# EAGLE design ARM-Cortex_M0 (EAGLE 7.7.0)
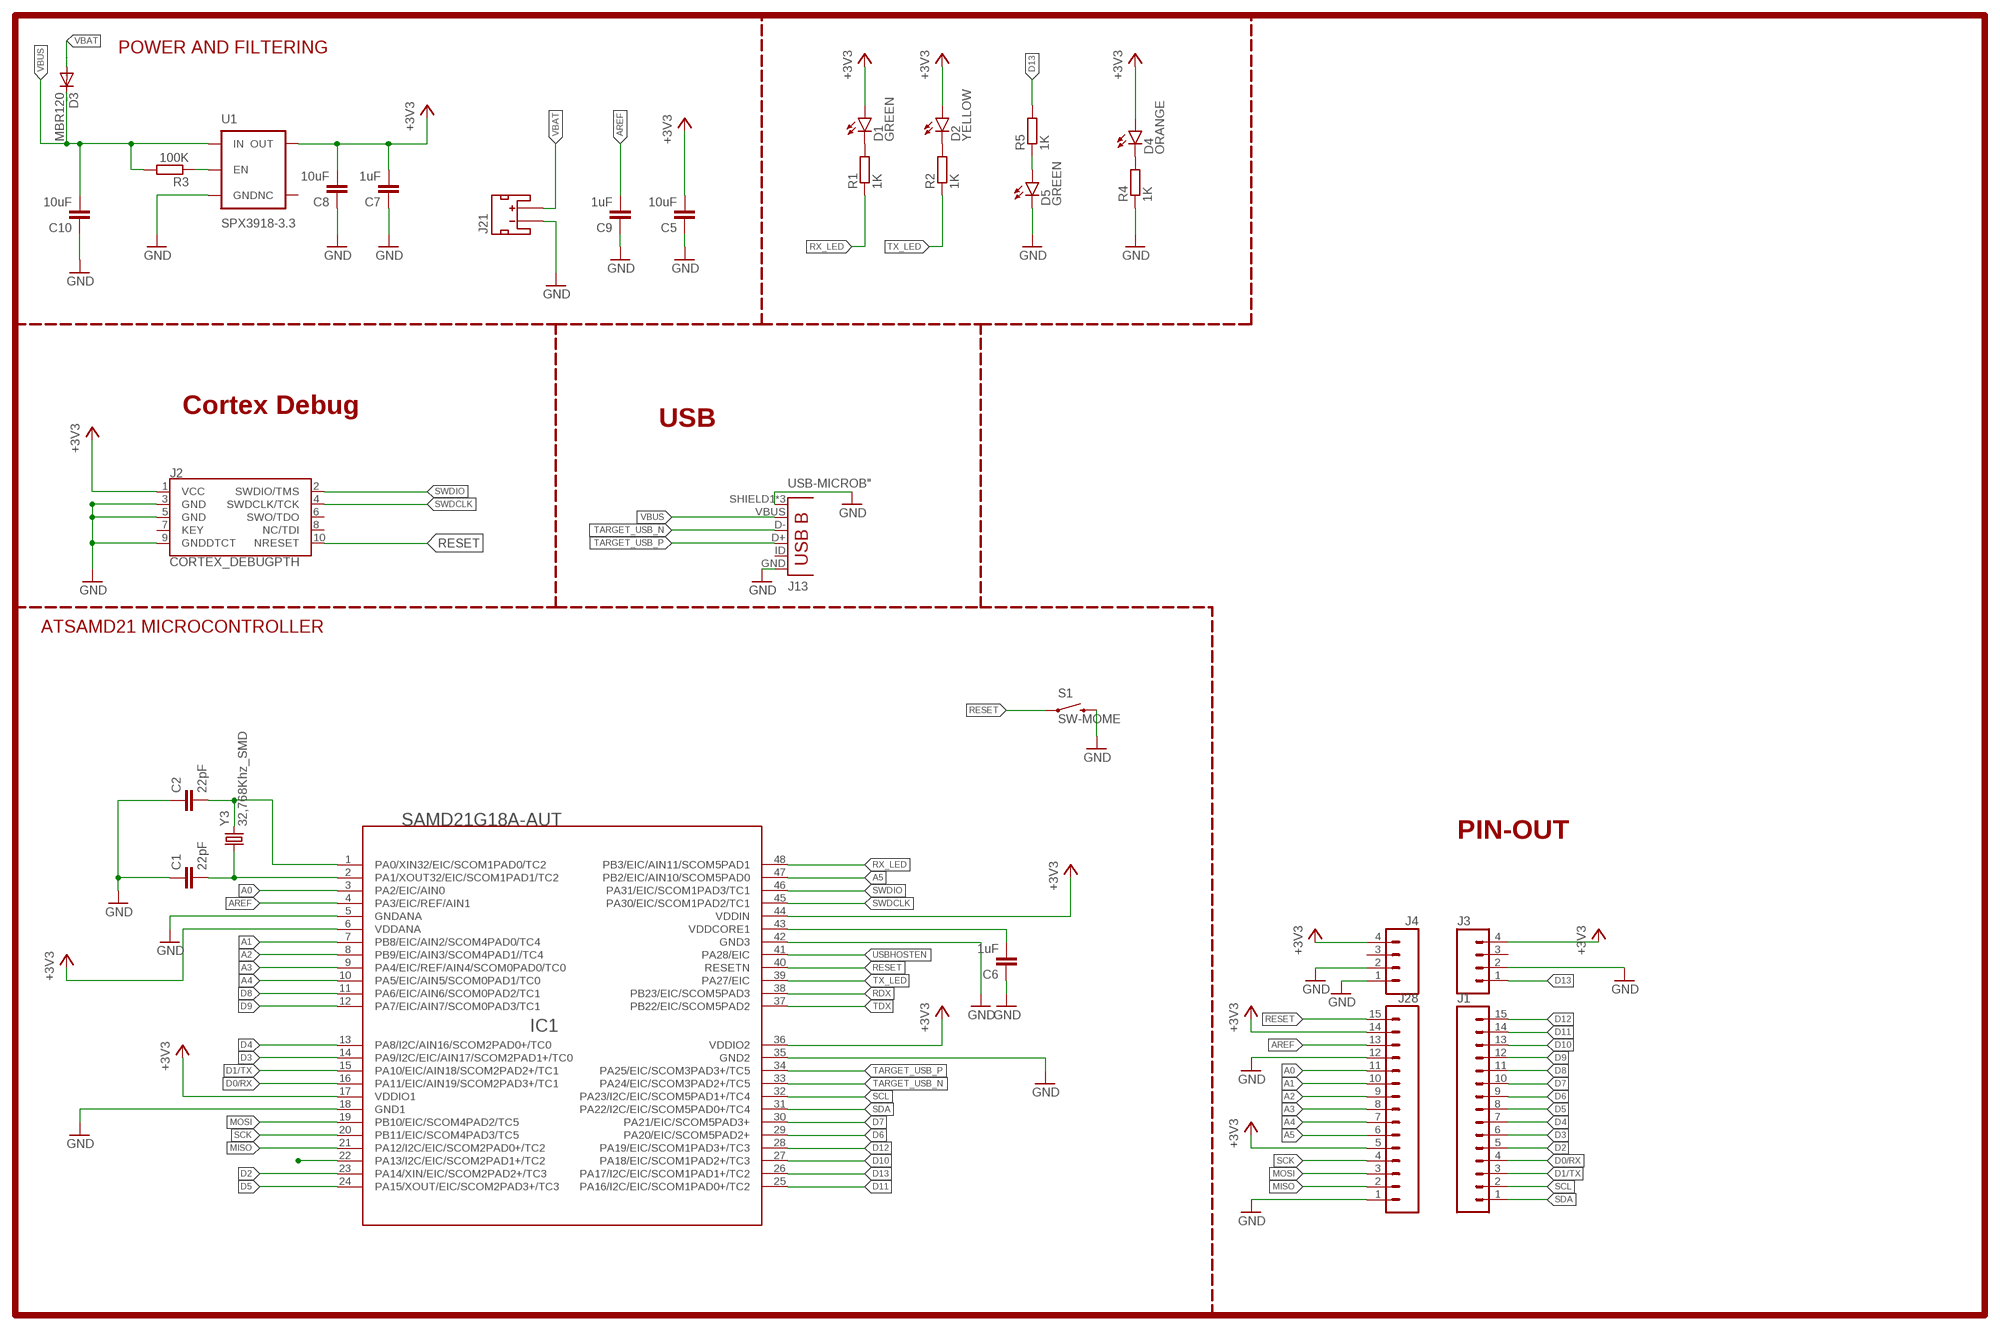
[diagram p0: schematic, sheet 1]

## Parts
C1  22pF  C-EUC0603  [C0603]
C2  22pF  C-EUC0603  [C0603]
C5  10uF  C-EUC0603  [C0603]
C6  1uF  C-EUC0603  [C0603]
C7  1uF  C-EUC0603  [C0603]
C8  10uF  C-EUC0603  [C0603]
C9  1uF  C-EUC0603  [C0603]
C10  10uF  C-EUC0603  [C0603]
D1  GREEN  LED0603  [LED-0603]
D2  YELLOW  LED0603  [LED-0603]
D3  MBR120  CGRM4001-G  [SOD-123_MINI-SMA]
D4  ORANGE  LED0603  [LED-0603]
D5  GREEN  LED0603  [LED-0603]
IC1  SAMD21G18A-AUT  1792_SAMD21G18A-AUT  [TQFP48-7X7]
J1  M15  [1X15]
J2  CORTEX_DEBUGPTH  [2X5-PTH-1.27MM]
J3  M04NO_SILK_ALL_ROUND  [1X04_NO_SILK_ALL_ROUND]
J4  M04NO_SILK_ALL_ROUND  [1X04_NO_SILK_ALL_ROUND]
J13  USB-MICROB"  [USB-B-MICRO-SMD_V03]
J21  JST_2MM_MALE  [JST-2-SMD]
J28  M15  [1X15]
R1  1K  R-EU_R0603  [R0603]
R2  1K  R-EU_R0603  [R0603]
R3  100K  R-EU_R0603  [R0603]
R4  1K  R-EU_R0603  [R0603]
R5  1K  R-EU_R0603  [R0603]
S1  SW-MOME  SWITCH-MOMENTARY-2SMD  [TACTILE-SWITCH-SMD]
U1  SPX3918-3.3  V_REG_AP2112K-3.3V  [SOT23-5]
Y3  32,768Khz_SMD  CRYSTALTXC-7A  [CRYSTAL-TXC-7A]

## Nets
+3V3: C5.2 C7.2 C8.2 D1.A D2.A D4.A IC1.6(VDDANA) IC1.17(VDDIO1) IC1.36(VDDIO2) IC1.44(VDDIN) J2.1(VCC) J3.4 J4.4 J28.5 J28.14 U1.5(OUT)
A0: IC1.3(PA2/EIC/AIN0) J28.11
A1: IC1.7(PB8/EIC/AIN2/SCOM4PAD0/TC4) J28.10
A2: IC1.8(PB9/EIC/AIN3/SCOM4PAD1//TC4) J28.9
A3: IC1.9(PA4/EIC/REF/AIN4/SCOM0PAD0/TC0) J28.8
A4: IC1.10(PA5/EIC/AIN5/SCOM0PAD1/TC0) J28.7
A5: IC1.47(PB2/EIC/AIN10/SCOM5PAD0) J28.6
AREF: C9.2 IC1.4(PA3/EIC/REF/AIN1) J28.13
D0/RX: IC1.16(PA11/EIC/AIN19/SCOM2PAD3+/TC1) J1.4
D1/TX: IC1.15(PA10/EIC/AIN18/SCOM2PAD2+/TC1) J1.3
D2: IC1.23(PA14/XIN/EIC/SCOM2PAD2+/TC3) J1.5
D3: IC1.14(PA9/I2C/EIC/AIN17/SCOM2PAD1+/TC0) J1.6
D4: IC1.13(PA8/I2C/AIN16/SCOM2PAD0+/TC0) J1.7
D5: IC1.24(PA15/XOUT/EIC/SCOM2PAD3+/TC3) J1.8
D6: IC1.29(PA20/EIC/SCOM5PAD2+) J1.9
D7: IC1.30(PA21/EIC/SCOM5PAD3+) J1.10
D8: IC1.11(PA6/EIC/AIN6/SCOM0PAD2/TC1) J1.11
D9: IC1.12(PA7/EIC/AIN7/SCOM0PAD3/TC1) J1.12
D10: IC1.27(PA18/EIC/SCOM1PAD2+/TC3) J1.13
D11: IC1.25(PA16/I2C/EIC/SCOM1PAD0+/TC2) J1.14
D12: IC1.28(PA19/EIC/SCOM1PAD3+/TC3) J1.15
D13: IC1.26(PA17/I2C/EIC/SCOM1PAD1+/TC2) J3.1 R5.2
GND: C1.1 C2.1 C5.1 C6.1 C7.1 C8.1 C9.1 C10.1 D5.C IC1.5(GNDANA) IC1.18(GND1) IC1.35(GND2) IC1.42(GND3) J2.3(GND) J2.5(GND) J2.9(GNDDTCT) J3.2 J4.1 J4.2 J13.GND J13.SHIELD1(SHIELD) J13.SHIELD2(SHIELD) J13.SHIELD3(SHIELD) J21.1(-) J28.1 J28.12 R4.1 S1.3 U1.2(GND)
MISO: IC1.21(PA12/I2C/EIC/SCOM2PAD0+/TC2) J28.2
MOSI: IC1.19(PB10/EIC/SCOM4PAD2/TC5) J28.3
N$1: C1.2 IC1.2(PA1/XOUT32/EIC/SCOM1PAD1/TC2) Y3.P$1
N$2: C2.2 IC1.1(PA0/XIN32/EIC/SCOM1PAD0/TC2) Y3.P$2
N$3: IC1.22(PA13/I2C/EIC/SCOM2PAD1+/TC2)
N$4: D1.C R1.2
N$5: D2.C R2.2
N$6: R3.1 U1.3(EN)
N$7: C6.2 IC1.43(VDDCORE1)
N$8: D4.C R4.2
N$10: D5.A R5.1
RDX: IC1.38(PB23/EIC/SCOM5PAD3)
RESET: IC1.40(RESETN) J2.10(NRESET) J28.15 S1.1
RX_LED: IC1.48(PB3/EIC/AIN11/SCOM5PAD1) R1.1
SCK: IC1.20(PB11/EIC/SCOM4PAD3/TC5) J28.4
SCL: IC1.32(PA23/I2C/EIC/SCOM5PAD1+/TC4) J1.2
SDA: IC1.31(PA22/I2C/EIC/SCOM5PAD0+/TC4) J1.1
SWDCLK: IC1.45(PA30/EIC/SCOM1PAD2/TC1) J2.4(SWDCLK/TCK)
SWDIO: IC1.46(PA31/EIC/SCOM1PAD3/TC1) J2.2(SWDIO/TMS)
TARGET_USB_N: IC1.33(PA24/EIC/SCOM3PAD2+/TC5) J13.D-
TARGET_USB_P: IC1.34(PA25/EIC/SCOM3PAD3+/TC5) J13.D+
TDX: IC1.37(PB22/EIC/SCOM5PAD2)
TX_LED: IC1.39(PA27/EIC) R2.1
USBHOSTEN: IC1.41(PA28/EIC)
VBAT: D3.A J21.2(+)
VBUS: C10.2 D3.C J13.VBUS R3.2 U1.1(IN)
Unconnected: J2.6(SWO/TDO) J2.7(KEY) J2.8(NC/TDI) J3.3 J4.3 J13.ID(USBID) J21.NC1(PAD1) J21.NC2(PAD2) U1.4(NC)

## Notes on the sheet
- POWER AND FILTERING
- Cortex Debug
- USB
- ATSAMD21 MICROCONTROLLER
- PIN-OUT

## Library data of the parts
C1 C2 C5-C10 = KarlVaello-Capacitors:C-EU: CAPACITOR, European symbol
D1 D2 D4 D5 = SparkFun-LED:LED: LEDs Standard schematic elements and footprints for 5mm, 3mm, 1206, and 0603 sized LEDs. 5mm - Spark Fun Electronics SKU : COM-00529 (and others)
D3 = diode:CGRM400*-G: Molded plasitc,JEDEC SOD-123/Mini SMA Source: Comchip CGRM4001-G.pdf
IC1 = KarlVaello-DigitalIC:1792_SAMD21G18A-AUT: Atmel D21 32bit ARM Cortex-M0 microcontroller - 48 PIN TQFP 256KB flash memory + 32KB SRAM
J1 J28 = SparkFun-Connectors:M15: Header 15 Standard 15-pin 0.1" header. Use with straight break away headers (SKU : PRT-00116), right angle break away headers (PRT-00553), swiss pins (PRT-00743), machine pins (PRT-00117), and female headers (PRT-00115).
J2 = SparkFun-Connectors:CORTEX_DEBUG: Cortex Debug Connector Datasheet <http://infocenter.arm.com/help/topic/com.arm.doc.faqs/attached/13634/cortex_debug_connectors.pdf>
J3 J4 = SparkFun-Connectors:M04: Header 4 Standard 4-pin 0.1" header. Use with straight break away headers (SKU : PRT-00116), right angle break away headers (PRT-00553), swiss pins (PRT-00743), machine pins (PRT-00117), and female headers (PRT-00115). Molex polarized connector foot print use with SKU : PRT-08231 with associated crimp pins and housings. 1MM SMD Version SKU: PRT-10208; PROD_ID: CONN-09696
J13 = KarlVaello-Connectors:USB-MICROB; PROD_ID: CONN-11752
J21 = SparkFun-Connectors:JST_2MM_MALE: Mates to single-cell LiPo batteries. CONN-11443 Now with smashable polarity marks!; BTM_NEG: -; BTM_POS: +; PROD_ID: CONN-11443; TOP_NEG: -; TOP_POS: +
R1-R5 = KarlVaello-Resistors:R-EU_: RESISTOR, European symbol
S1 = SparkFun-Electromechanical:SWITCH-MOMENTARY-2: Various NO switches- pushbuttons, reed, etc; PROD_ID: SWCH-08247
U1 = SparkFun-PowerIC:V_REG_AP2112: AP2112 - 600mA CMOS LDO Regulator w/ Enable The AP2112 is CMOS process low dropout linear regulator with enable function, the regulator delivers a guaranteed 600mA (min.) continuous load current. Features Output Voltage Accuracy: ±1.5% Output Current: 600mA (Min.) Foldback Short Current Protection: 50mA Enable Function to Turn ON/OFF VOUT Low Dropout Voltage (3.3V): 250mV (Typ.) @IOUT=600mA Excellent Load Regulation: 0.2%/A (Typ.) Excellent Line Regulation: 0.02%/V (Typ.) Low Quiescent Current: 55μA (Typ.) Low Standby Current: 0.01μA (Typ.) Low Output Noise: 50μVRMS PSRR: 100Hz -65dB, 1kHz -65dB OTSD Protection Stable with 1.0μF Flexible Cap: Ceramic, Tantalum and Aluminum Electrolytic Operation Temperature Range: -40°C to 85°C ESD: MM 400V, HBM 4000V; PROD_ID: VREG-12457; VALUE: 3.3V
Y3 = SparkFun-FreqCtrl:CRYSTAL: Various standard crystals. Proven footprints.

## Board
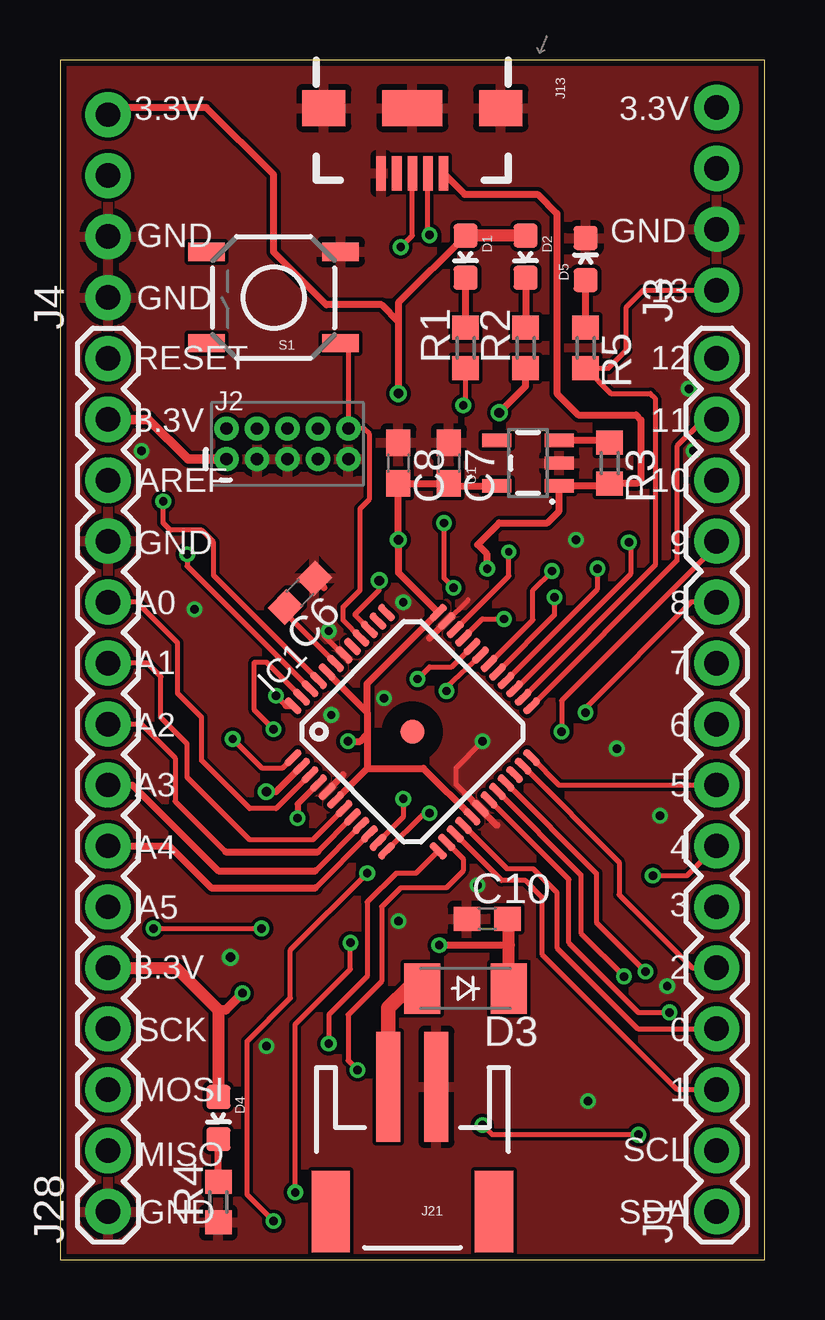
[diagram p1: board, top side]
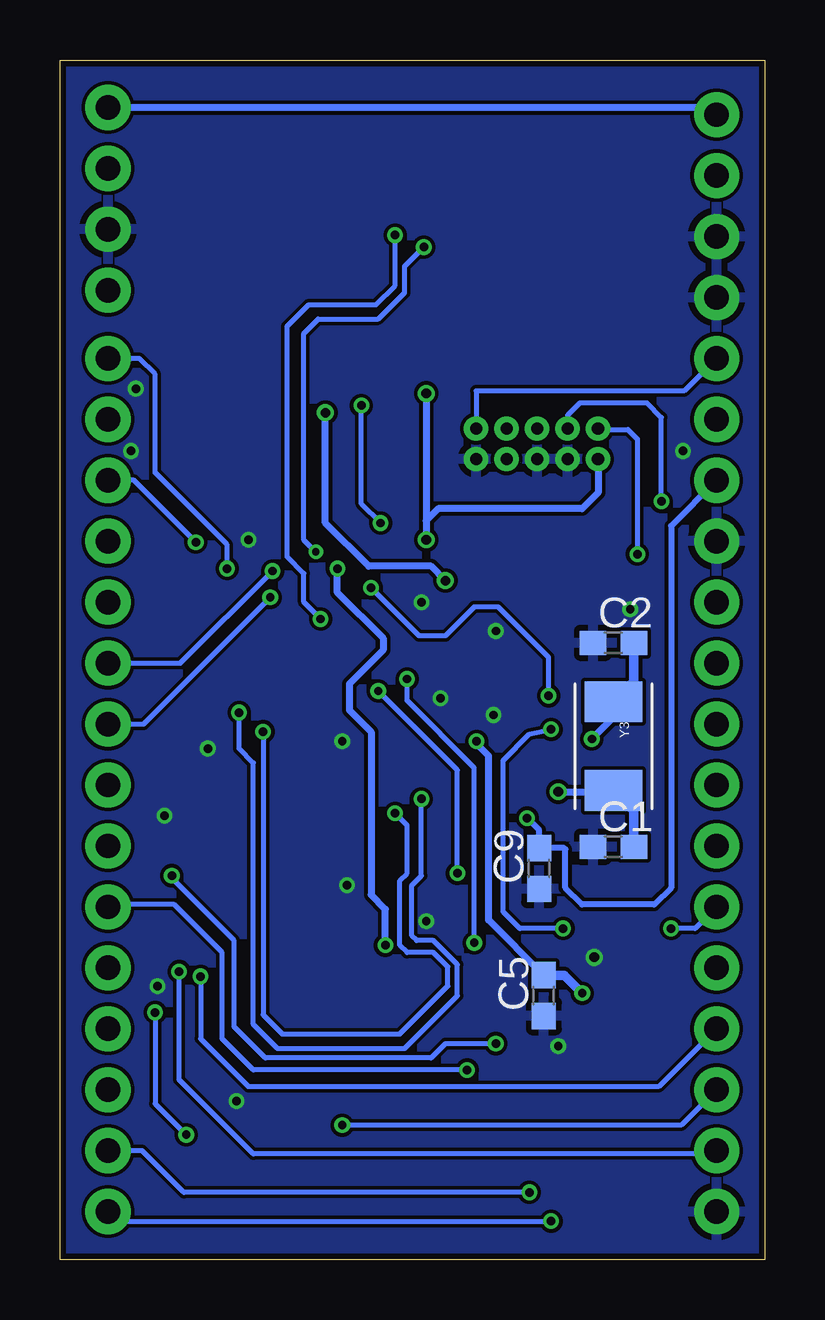
[diagram p2: board, bottom side, seen from below]

Size 29.36 x 50 mm. Coordinates in mm from the lower left corner, seen from the top.
Outline: 0,0 29.36,0 29.36,50 0,50 0,0
Copper layers (1*16): Top 0.035mm / dielectric 1.5mm / Bottom 0.035mm
Design rules "SeeedStudio_2layer_DRU_no_angle_20140221": minimum track width 6mil, minimum drill 12mil, track to track 6mil, track to pad 6mil, pad to pad 6mil, via to via 6mil, smd to smd 0mil, copper to edge 10mil, drill to drill 10mil, minimum pad ring 10mil, minimum via ring 6mil, stop-mask expansion 2mil, vias tented up to drill 100mil, thermal gap 10mil

### Footprints (pad centres in the part's own frame; a part is rotated, then mirrored left to right if it is on the bottom)
C0603 = smd 1.1 x 1: 1 -0.85,0; 2 0.85,0
LED-0603 = smd 1 x 1: A 0,-0.877; C 0,0.877
SOD-123_MINI-SMA = smd 1.5 x 2.1: A 1.8,0; C -1.8,0
TQFP48-7X7 = smd 0.85 x 0.32: 1 -4.275,2.75; 2 -4.275,2.25; 3 -4.275,1.75; 4 -4.275,1.25; 5 -4.275,0.75; 6 -4.275,0.25; 7 -4.275,-0.25; 8 -4.275,-0.75; 9 -4.275,-1.25; 10 -4.275,-1.75; 11 -4.275,-2.25; 12 -4.275,-2.75; 25 4.275,-2.75; 26 4.275,-2.25; 27 4.275,-1.75; 28 4.275,-1.25; 29 4.275,-0.75; 30 4.275,-0.25; 31 4.275,0.25; 32 4.275,0.75; 33 4.275,1.25; 34 4.275,1.75; 35 4.275,2.25; 36 4.275,2.75 | smd 0.32 x 0.85: 13 -2.75,-4.275; 14 -2.25,-4.275; 15 -1.75,-4.275; 16 -1.25,-4.275; 17 -0.75,-4.275; 18 -0.25,-4.275; 19 0.25,-4.275; 20 0.75,-4.275; 21 1.25,-4.275; 22 1.75,-4.275; 23 2.25,-4.275; 24 2.75,-4.275; 37 2.75,4.275; 38 2.25,4.275; 39 1.75,4.275; 40 1.25,4.275; 41 0.75,4.275; 42 0.25,4.275; 43 -0.25,4.275; 44 -0.75,4.275; 45 -1.25,4.275; 46 -1.75,4.275; 47 -2.25,4.275; 48 -2.75,4.275 | smd 1 x 1: P$1 0,0
1X15 = drill 1.016 pad 1.88: 1 0,0; 2 2.54,0; 3 5.08,0; 4 7.62,0; 5 10.16,0; 6 12.7,0; 7 15.24,0; 8 17.78,0; 9 20.32,0; 10 22.86,0; 11 25.4,0; 12 27.94,0; 13 30.48,0; 14 33.02,0; 15 35.56,0
2X5-PTH-1.27MM = drill 0.508 pad 1: 1 -2.54,-0.635; 2 -2.54,0.635; 3 -1.27,-0.635; 4 -1.27,0.635; 5 0,-0.635; 6 0,0.635; 7 1.27,-0.635; 8 1.27,0.635; 9 2.54,-0.635; 10 2.54,0.635
1X04_NO_SILK_ALL_ROUND = drill 1.016 pad 1.88: 1 0,0; 2 2.54,0; 3 5.08,0; 4 7.62,0
USB-B-MICRO-SMD_V03 = smd 1.45 x 0.4: D+ 2.725,0; D- 2.725,0.65; GND 2.725,-1.3; ID 2.725,-0.65; VBUS 2.725,1.3 | smd 1.5 x 1.8: SHIELD1 0,3.685; SHIELD2 0,-3.685 | smd 1.5 x 2.5: SHIELD3 0,0
JST-2-SMD = smd 1 x 4.6: 1 -1,-3.7; 2 1,-3.7 | smd 1.6 x 3.4: NC1 -3.4,1.5; NC2 3.4,1.5
R0603 = smd 1 x 1.1: 1 -0.85,0; 2 0.85,0
TACTILE-SWITCH-SMD = smd 1.524 x 0.762: 1 -2.794,1.905; 2 2.794,1.905; 3 -2.794,-1.905; 4 2.794,-1.905
SOT23-5 = smd 0.55 x 1.2: 1 -0.95,-1.3; 2 0,-1.3; 3 0.95,-1.3; 4 0.95,1.3; 5 -0.95,1.3
CRYSTAL-TXC-7A = smd 1.7 x 2.4: P$1 1.85,0; P$2 -1.85,0

### Placement (x,y rotation side)
C1  6.3,17.2 0 bottom
C2  6.3,25.7 0 bottom
C5  9.2,11 90 bottom
C6  10,27.8 225 top
C7  16.2,33.2 270 top
C8  14.1,33.2 270 top
C9  9.4,16.3 90 bottom
C10  17.8,14.2 0 top
D1  16.9,41.8 180 top
D2  19.4,41.8 180 top
D3  16.9,11.3 180 top
D4  6.6,5.9 180 top
D5  21.9,41.7 0 top
IC1  14.68,22 45 top
J1  27.36,2 90 top
J2  9.48,34 0 top
J3  27.36,40.4 90 top
J4  2,40.1 90 top
J13  14.68,48 270 top
J21  14.68,3.5 180 top
J28  2,2 90 top
R1  16.9,38 90 top
R2  19.4,38 90 top
R3  22.9,33.2 270 top
R4  6.6,2.4 90 top
R5  21.9,38 270 top
S1  8.9,40.1 180 top
U1  19.5,33.2 90 top
Y3  6.3,21.4 270 bottom

### Tracks (layer width: path | path; a pad name or v marks a point on that pad's centre or on a via)
+3V3  (via drill 0.35, 0.4)
  Top 0.3: IC1.44 11.13,24.47 12.8,22.8 | 12.8,22.8 12.8,21.9 | 12.8,21.9 12.8,20.47 | 12.8,20.47 IC1.6 | 12.8,20.47 15.15,20.47 IC1.17 | 12.8,22.8 12.8,24.01 IC1.36 14.1,28.63 v14.1,30 C8.2 C7.2 16.3,32.25 U1.5 | D1.A 14.1,39.88 v14.1,36.1 14.1,39.1 13.4,39.8 11.1,39.8 8.9,42 8.9,45.22 6.1,48.02 2.3,48.02 J4.4 | v12,21.6 12.5,21.6 12.8,21.9
  Top 0.4: J28.14 3.68,35.02 5.33,33.37 J2.1 | v7.6,11.1 6.9,10.4 6.6,10.4
  Top 0.5: J28.5 4.84,12.16 6.6,10.4 D4.A | D2.A D1.A
  Bottom 0.3: v14.1,36.1 14.1,30.8 | 14.1,30.8 v14.1,30 | 11.95,21.55 v12,21.6 12,21.5 11.5,21 11.5,14.15 C5.2 | J2.1 6.94,31.96 7.6,31.3 13.6,31.3 14.1,30.8 | J4.4 2.3,48.02 J3.4
  Bottom 0.4: v7.6,11.1 8.35,11.85 C5.2
A0
  Top 0.2: IC1.3 9.01,18.8 7.9,18.8 5.9,20.8 5.9,22.6 4.9,23.6 4.9,25.7 3.2,27.4 J28.11
A1
  Top 0.2: IC1.7 10.53,17.5 7.9,17.5 5.3,20.1 5.3,21.5 4.2,22.6 4.2,24.3 3.64,24.86 J28.10
A2
  Top 0.2: J28.9 3.38,22.32 4.8,20.9 4.8,19.1 6.9,17 | 10.74,17 IC1.8
  Top 0.3: 6.9,17 10.74,17
A3
  Top 0.2: 10.65,16.2 IC1.9
  Top 0.3: J28.8 3.02,19.78 6.6,16.2 10.65,16.2
A4
  Top 0.2: 10.65,15.5 IC1.10
  Top 0.3: J28.7 4.56,17.24 6.3,15.5 10.65,15.5
A5  (via drill 0.35)
  Top 0.2: v8.9,22.1 8.1,22.9 8.1,24.9 8.6,24.9 IC1.47 | v3.9,13.8 v8.4,13.8
  Bottom 0.2: v8.9,22.1 9.8,21.9 10.9,20.8 10.9,14.5 10.2,13.8 v8.4,13.8 | J28.6 2.9,13.8 v3.9,13.8
AREF  (via drill 0.35)
  Top 0.25: IC1.4 9.9,18.99 v9.9,18.4
  Bottom 0.25: J28.13 3.9,30.58 3.9,15.5 4.6,14.8 7.6,14.8 8.3,15.5 8.3,17.1 8.35,17.15 C9.2 9.4,17.9 v9.9,18.4
D0/RX
  Top 0.2: IC1.16 18.61,16.3 19.7,16.3 20.7,15.3 20.7,13 24.08,9.62 J1.4
D1/TX
  Top 0.2: J1.3 25.72,7.08 20.1,12.7 20.1,15.1 19.4,15.8 18.41,15.8 IC1.15
D2
  Top 0.2: IC1.23 23.3,16.56 23.3,15.2 26.34,12.16 J1.5
D3  (via drill 0.35)
  Top 0.2: IC1.14 16.8,16.7 16.8,16.2 16.1,15.5 14.2,15.5 13.4,14.7 13.4,11.6 12,10.2 12,8.3 v12.4,7.9
  Bottom 0.2: v12.4,7.9 21.3,7.9 22.6,9.2 22.6,12.8 24.6,14.8 27.26,14.8 J1.6
D4  (via drill 0.35)
  Top 0.2: J1.7 26.12,16 v24.7,16 | IC1.13 14.83,16.1 14,16.1 12.8,14.9 12.8,11.8 11.2,10.2 v11.2,9
  Bottom 0.2: v24.7,16 24.7,15.9 22.1,13.3 22.1,9.7 20.8,8.4 13.9,8.4 13.3,9 v11.2,9
D5
  Top 0.2: IC1.24 20.79,19.78 J1.8
D6  (via drill 0.35)
  Top 0.2: v20.6,27.6 20.6,26.86 IC1.29
  Bottom 0.2: J1.9 25.88,22.32 v20.6,27.6
D7  (via drill 0.35)
  Top 0.2: IC1.30 19.7,26.67 19.7,27.9 v20.5,28.7
  Bottom 0.2: J1.10 24.34,24.86 v20.5,28.7
D8  (via drill 0.35)
  Top 0.2: J1.11 26.3,27.4 21.9,23 v21.9,22.8 | v14.3,19.2 14.3,18.44 IC1.11
  Top 0.3: IC1.11 13.29,17.39
  Bottom 0.2: 14.4,19.1 v14.3,19.2 14.3,16 14.7,15.6 14.7,13.5 14.5,13.3 13.8,13.3 12.8,12.3 12.8,11 15,8.8 20.3,8.8 21.3,9.8 21.3,20.7 21.9,21.3 v21.9,22.8
D9  (via drill 0.35)
  Top 0.2: J1.12 27.36,29.76 20.9,23.3 v20.9,22 | v15.4,18.6 15.17,18.6 IC1.12
  Bottom 0.2: v15.4,18.6 14.9,18.1 14.9,16.1 15.2,15.8 15.2,13.1 14.9,12.8 13.8,12.8 13.2,12.2 13.2,11.4 15.2,9.4 20.1,9.4 20.9,10.2 v20.9,22
D10  (via drill 0.35)
  Top 0.2: 18.98,23.79 23.8,28.6 23.8,29.8
  Top 0.3: IC1.27 18.98,23.79 | 23.8,29.8 v23.7,29.9
  Bottom 0.2: v23.7,29.9 26.28,32.48 J1.13
D11
  Top 0.2: J1.14 26.82,35.02 25.7,33.9 25.7,29.13 IC1.25
D12  (via drill 0.35)
  Top 0.2: IC1.28 22.4,27.95 v22.4,28.8
  Bottom 0.2: v22.4,28.8 22.4,29.8 25.4,32.8 25.4,36.9 26.06,37.56 J1.15
D13
  Top 0.2: J3.1 24.3,40.4 23.6,39.7 23.6,37.9 22.85,37.15 R5.2 22.95,36.1 24.6,36.1 24.8,35.9 24.8,28.94 IC1.26
GND  (via drill 0.35, 0.4)
  Top 0.2: 11.8,25.2 11,26 | IC1.35 17,27.5 | 18.2,18.1 16.5,19.8 16.5,20.5 v17.6,21.6
  Top 0.3: IC1.5 11.13,19.53 11.8,20.2 | IC1.35 15.4,25.9 | 11.83,25.17 IC1.42 11.8,25.2 | IC1.18 17.5,18.8 | 17.5,18.8 16.9,19.4 | 11,28 C6.1 | 17.5,18.8 18.2,18.1
  other vias: 23.2,21.3 25,18.5 7.1,12.6 11.3,22.7 22,6.6 25.3,11.4 21.5,30 8.6,8.9 17.4,15.6 13.5,23.4 11.2,26.2 14.1,14.1 5.6,27.1 14.3,27.4 3.4,33.7 26.4,33.7 26.2,36.3
  pour Top: -4,54 33.7,53.9 33.7,-4.6 -4,-4.5
  pour Bottom: -2,51.5 31,51.3 31,-2.2 -2,-2
MISO  (via drill 0.35)
  Top 0.2: v24.4,12 22.35,14.05 22.35,16.1 IC1.21
  Bottom 0.2: J28.2 2.14,4.4 21.3,4.4 24.4,7.5 v24.4,12
MOSI  (via drill 0.35)
  Top 0.2: v25.4,10.3 24.1,10.3 21.2,13.2 21.2,15.83 IC1.19 | v24.1,5.2 18,5.2 v17.6,5.6
  Bottom 0.2: J28.3 3.48,5.6 v17.6,5.6 | v25.4,10.3 25.4,6.5 v24.1,5.2
N$1  (via drill 0.4)
  Top 0.3: IC1.2 9,19.5 v8.6,19.5
  Bottom 0.3: v8.6,19.5 6.35,19.5 arc-90 Y3.P$1
  Bottom 0.4: C1.2 5.45,18.7 Y3.P$1
N$2  (via drill 0.35)
  Top 0.2: v7.2,21.7 8.4,20.5 9.29,20.5 IC1.1
  Bottom 0.3: Y3.P$2 6.3,22.6 v7.2,21.7
  Bottom 0.4: C2.2 5.45,24.1 Y3.P$2
N$4
  Top 0.3: R1.2 D1.C
N$5
  Top 0.3: D2.C R2.2
N$6
  Top 0.3: U1.3 22.9,34.15 R3.1
N$7
  Top 0.2: 9.4,26.93 IC1.43
  Top 0.3: C6.2 9.4,26.93
N$8
  Top 0.3: R4.2 D4.C
N$10
  Top 0.3: R5.1 D5.A
RESET
  Top 0.2: IC1.40 11.8,26.65 11.8,27.2 12.5,27.9 12.5,31.3 12.9,31.7 12.9,34.4 12.66,34.63 J2.10 12.02,37.87 S1.1
  Bottom 0.2: J28.15 3.36,36.2 12.02,36.2 J2.10
RX_LED  (via drill 0.35)
  Top 0.2: 9.42,23.08 v9,23.5 | v16.4,28 16,28.4 v16,30.7 | v16.8,35.6 16.9,35.7 R1.1
  Top 0.3: IC1.48 9.42,23.08
  Bottom 0.2: v9,23.5 9,25.1 11.1,27.2 12.1,27.2 13.3,26 14.4,26 v16.4,28 | v16,30.7 16.8,31.5 v16.8,35.6
SCK  (via drill 0.35)
  Top 0.2: v23.5,11.8 21.7,13.6 21.7,16.04 IC1.20
  Bottom 0.2: J28.4 4.42,7.2 21.5,7.2 23.5,9.2 v23.5,11.8
SCL  (via drill 0.35)
  Top 0.2: v9.8,2.8 9.8,9.8 12.1,12.1 v12.1,13.2 | v14.9,24.2 15.4,24.7 16.32,24.7 IC1.32
  Bottom 0.2: v12.1,13.2 12.1,20.5 14.9,23.3 v14.9,24.2 | v9.8,2.8 24.2,2.8 25.94,4.54 J1.2
SDA  (via drill 0.35)
  Top 0.2: v8.9,1.6 7.8,2.7 7.8,9.1 9.6,10.9 9.6,12.9 v12.8,16.1 | v16.1,23.7 16.1,23.87 IC1.31
  Bottom 0.2: J1.1 26.96,1.6 v8.9,1.6 | v12.8,16.1 12.8,20.4 v16.1,23.7
SWDCLK  (via drill 0.35)
  Top 0.2: IC1.45 6.4,28.51 6.4,29.9 5.9,30.4 4.6,30.4 4.3,30.7 v4.3,31.6
  Bottom 0.2: v4.3,31.6 4.3,35.1 4.9,35.7 7.7,35.7 8.21,35.19 J2.4
SWDIO  (via drill 0.35)
  Top 0.2: v5.3,29.4 5.3,28.91 IC1.46
  Bottom 0.2: 6.91,34.6 5.7,34.6 5.3,34.2 v5.3,29.4
  Bottom 0.3: J2.2 6.91,34.6
TARGET_USB_N  (via drill 0.35)
  Top 0.152: IC1.33
  Top 0.2: v15.4,42.7 15.33,42.77 J13.D- | IC1.33 17.6,26.7 v18.5,26.7
  Bottom 0.2: v15.4,42.7 15.4,40.6 16.2,39.8 19,39.8 19.9,38.9 19.9,29.3 19.2,28.6 19.2,27.4 v18.5,26.7
TARGET_USB_P  (via drill 0.3, 0.35)
  Top 0.2: v14.2,42.2 14.68,42.68 J13.D+ | IC1.34 18.7,28.5 v18.7,29.5
  Bottom 0.2: v14.2,42.2 15,41.4 15,40.3 16.1,39.2 18.6,39.2 19.2,38.6 19.2,30 v18.7,29.5
TX_LED  (via drill 0.4)
  Top 0.2: IC1.39 12.3,26.86 12.3,26.9 13.3,27.9 v13.3,28.3
  Top 0.3: v18.3,35.3 19.4,36.4 R2.1
  Bottom 0.3: v13.3,28.3 13.9,28.9 16.5,28.9 18.3,30.7 v18.3,35.3
VBAT
  Top 0.6: J21.2 13.68,10.48 14.5,11.3 D3.A
VBUS  (via drill 0.35)
  Top 0.3: J13.VBUS 16.86,44.4 19.9,44.4 20.7,43.6 20.7,36.1 21.6,35.2 24,35.2 24.2,35 24.2,32.5 24.05,32.35 R3.2 22.8,32.25 U1.1 20.8,31.2 20.3,30.7 18.3,30.7 17.4,29.8 17.8,29.4 v17.8,28.8 | 18.7,13.1 18.65,13.15 C10.2 18.65,13.1 v15.8,13.1
  Top 0.5: D3.C 18.7,13.1 18.7,14.15 C10.2
  Bottom 0.3: v15.8,13.1 15.8,14.6 16.4,15.2 16.4,22 17.3,22.9 17.3,24 15.9,25.4 15.9,25.9 17.8,27.8 v17.8,28.8

### Text on the board
_tsilk: 3.3V | 3.3V | GND | GND | GND | 13 | RESET | 12 | 3.3V | 11 | AREF | 10 | GND | 9 | A0 | 8 | A1 | 7 | A2 | 6 | A3 | 5 | A4 | 4 | A5 | 3 | 3.3V | 2 | SCK | 0 | MOSI | 1 | SCL | MISO | GND | SDA